# Altium project ASPLogger_Control_Unit.PrjPcb (part 2 of 2)

## Sheet ASP.SchDoc
size A1; SheetNumber: 5; SheetTotal: 5; SPICEModelCacheHRBINYFA: <root> / <DocumentId>HRBINYFA</DocumentId> / <CacheFrame Number="0"> / <Model Name="cap" Kind="MDL"> / <Text>*Default semiconductor capacitor / .MODEL CAP C()</Text> / </Model> / </CacheFrame> / </root>
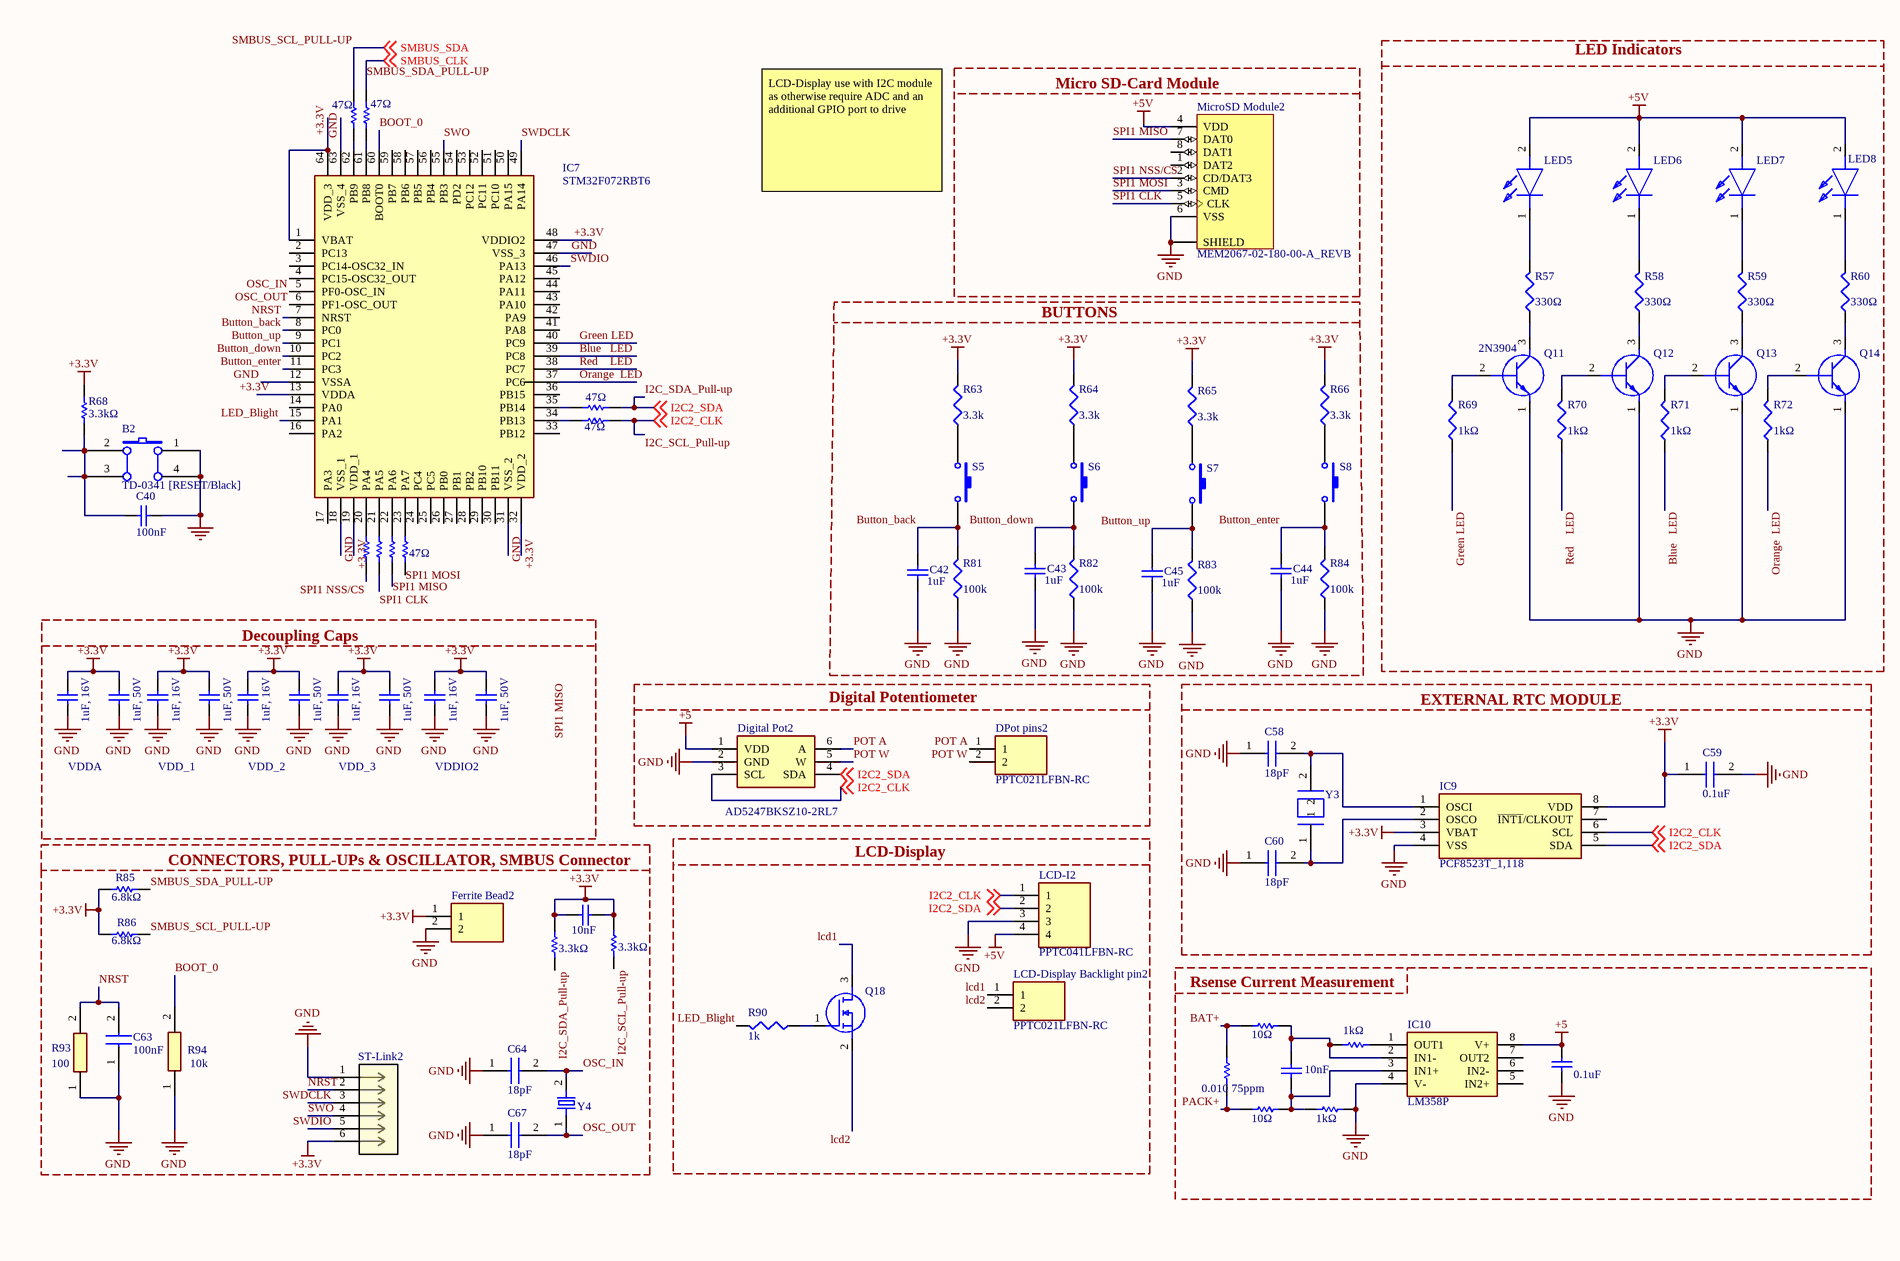
[diagram p4: ASP.SchDoc, left]
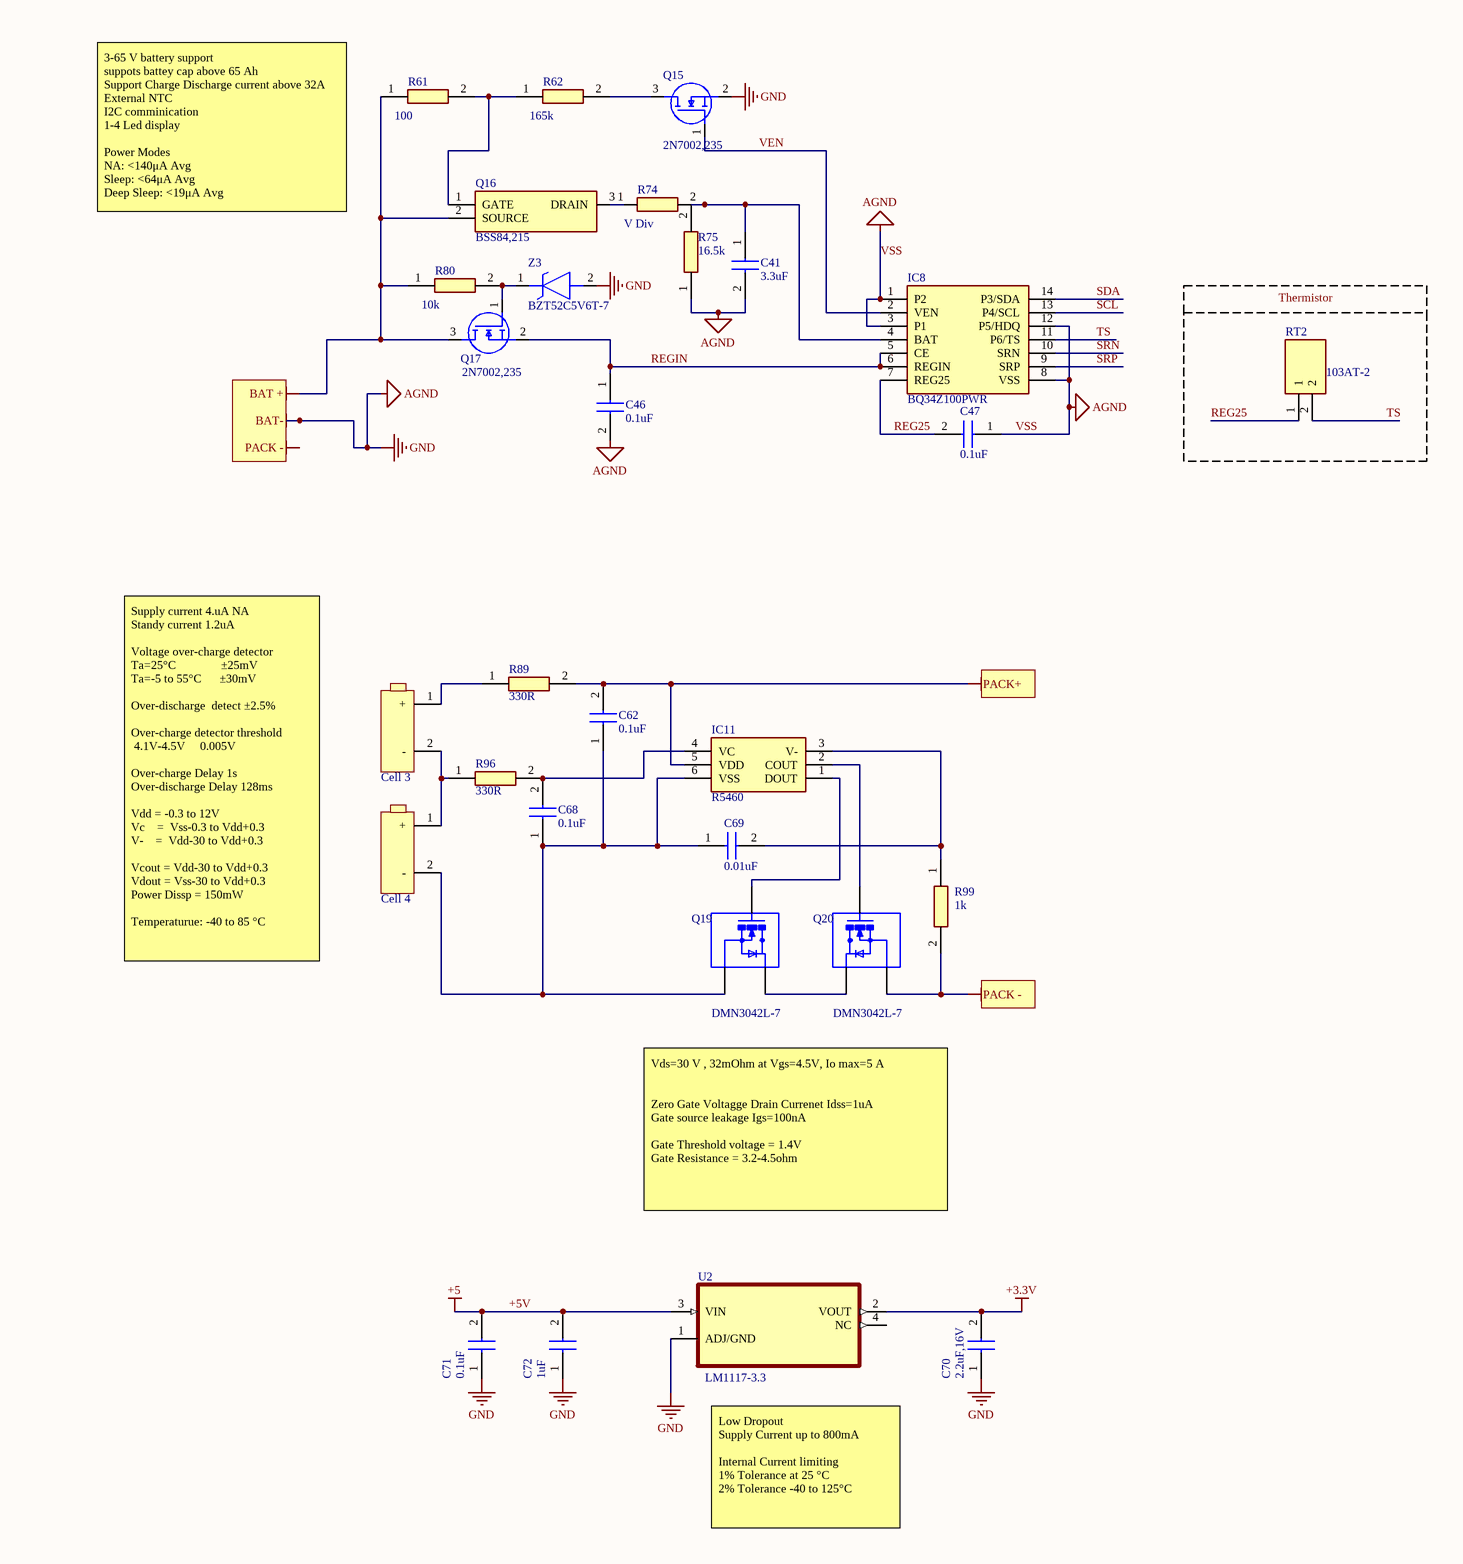
[diagram p5: ASP.SchDoc, right]

### Parts
B2  TD-0341 [RESET/Black]  [PB10]
C40  100nF  [0603C]
C41  3.3uF  [CAPC1608X90N]
C42  value 1uF  [RAD-0.3]  (hidden comment: Cap)
C43  value 1uF  [RAD-0.3]  (hidden comment: Cap)
C44  value 1uF  [RAD-0.3]  (hidden comment: Cap)
C45  value 1uF  [RAD-0.3]  (hidden comment: Cap)
C46  0.1uF  [CAPC1608X90N]
C47  0.1uF  [CAPC1608X90N]
C48  value 1uF, 16V  [RAD-0.3]  (hidden comment: Cap)
C49  value 1uF, 50V  [RAD-0.3]  (hidden comment: Cap)
C50  value 1uF, 16V  [RAD-0.3]  (hidden comment: Cap)
C51  value 1uF, 50V  [RAD-0.3]  (hidden comment: Cap)
C52  value 1uF, 16V  [RAD-0.3]  (hidden comment: Cap)
C53  value 1uF, 50V  [RAD-0.3]  (hidden comment: Cap)
C54  value 1uF, 16V  [RAD-0.3]  (hidden comment: Cap)
C55  value 1uF, 50V  [RAD-0.3]  (hidden comment: Cap)
C56  value 1uF, 16V  [RAD-0.3]  (hidden comment: Cap)
C57  value 1uF, 50V  [RAD-0.3]  (hidden comment: Cap)
C58  18pF  [CAPC3216X180N]
C59  0.1uF  [CAPC3216X180N]
C60  18pF  [CAPC3216X180N]
C61  value 10nF  [RAD-0.3]  (hidden comment: Cap)
C62  0.1uF  [CAPC3216X180N]
C63  100nF  [CAPC3216X180N]
C64  18pF  [CAPC3216X180N]
C65  value 0.1uF  [RAD-0.3]  (hidden comment: Cap)
C66  value 10nF  [RAD-0.3]  (hidden comment: Cap)
C67  18pF  [CAPC3216X180N]
C68  0.1uF  [CAPC3216X180N]
C69  0.01uF  [CAPC3216X180N]
C70  2.2uF,16V  [CAPC1608X90N]
C71  0.1uF  [CAPC1608X90N]
C72  1uF  [CAPC1608X90N]
Cell_3  Cell  [Cell]  (value not drawn)
Cell_4  Cell  [Cell]  (value not drawn)
Digital_Pot2  AD5247BKSZ10-2RL7  [SOT65P210X110-6N]
DPot_pins2  PPTC021LFBN-RC  [RHDR2W80P0X254_1X2_558X254X850P]
Ferrite_Bead2  2506033007Y3  [BEADC1608X110N]  (value not drawn)
IC7  STM32F072RBT6  [QFP50P1200X1200X160-64N]
IC8  BQ34Z100PWR  [SOP65P640X120-14N]
IC9  PCF8523T_1,118  [SOIC127P600X175-8N]
IC10  LM358P  [DIP794W53P254L959H508Q8N]
IC11  R5460  [SOT95P280X140-6N]
LCD-Display_Backlight_pin2  PPTC021LFBN-RC  [RHDR2W80P0X254_1X2_558X254X850P]
LCD-I2  PPTC041LFBN-RC  [RHDR4W80P0X254_1X4_1066X254X850P]
LED5  L-424IDT  [T-1_(3MM)_CYLINDRICAL_LED_LAMP]  (value not drawn)
LED6  L-424IDT  [T-1_(3MM)_CYLINDRICAL_LED_LAMP]  (value not drawn)
LED7  L-424IDT  [T-1_(3MM)_CYLINDRICAL_LED_LAMP]  (value not drawn)
LED8  L-424IDT  [T-1_(3MM)_CYLINDRICAL_LED_LAMP]  (value not drawn)
MicroSD_Module2  MEM2067-02-180-00-A_REVB  [GCT_MEM2067-02-180-00-A_REVB]
Q11  2N3904  [TO-92]
Q12  2n3904  [TO-92]  (value not drawn)
Q13  2n3904  [TO-92]  (value not drawn)
Q14  2n3904  [TO-92]  (value not drawn)
Q15  2N7002,235  [SOT95P230X110-3N]
Q16  BSS84,215  [SOT95P230X110-3N]
Q17  2N7002,235  [SOT95P230X110-3N]
Q18  DMG6968UQ-7  [SOT96P240X100-3N]  (value not drawn)
Q19  DMN3042L-7  [SOT91P240X110-3N]
Q20  DMN3042L-7  [SOT91P240X110-3N]
R55  value 47Ω  [AXIAL-0.3]  (hidden comment: Res1)
R56  value 47Ω  [AXIAL-0.3]  (hidden comment: Res1)
R57  value 330Ω  [J1-0603]  (hidden comment: 330)
R58  value 330Ω  [J1-0603]  (hidden comment: 330)
R59  value 330Ω  [J1-0603]  (hidden comment: 330)
R60  value 330Ω  [J1-0603]  (hidden comment: 330)
R61  100  [RESC1608X55N]
R62  165k  [RESC1608X55N]
R63  value 3.3k  [J1-0603]  (hidden comment: Res3)
R64  value 3.3k  [J1-0603]  (hidden comment: Res3)
R65  value 3.3k  [J1-0603]  (hidden comment: Res3)
R66  value 3.3k  [J1-0603]  (hidden comment: Res3)
R67  value 47Ω  [AXIAL-0.3]  (hidden comment: Res1)
R68  value 3.3kΩ  [AXIAL-0.3]  (hidden comment: Res1)
R69  value 1kΩ  [J1-0603]  (hidden comment: Res3)
R70  value 1kΩ  [J1-0603]  (hidden comment: Res3)
R71  value 1kΩ  [J1-0603]  (hidden comment: Res3)
R72  value 1kΩ  [J1-0603]  (hidden comment: Res3)
R73  value 47Ω  [AXIAL-0.3]  (hidden comment: Res1)
R74  V Div  [RESC1608X55N]
R75  16.5k  [RESC1608X55N]
R76  Res1  [AXIAL-0.3]  (value not drawn)
R77  Res1  [AXIAL-0.3]  (value not drawn)
R78  Res1  [AXIAL-0.3]  (value not drawn)
R79  value 47Ω  [AXIAL-0.3]  (hidden comment: Res1)
R80  10k  [RESC1608X55N]
R81  value 100k  [J1-0603]  (hidden comment: Res3)
R82  value 100k  [J1-0603]  (hidden comment: Res3)
R83  value 100k  [J1-0603]  (hidden comment: Res3)
R84  value 100k  [J1-0603]  (hidden comment: Res3)
R85  value 6.8kΩ  [AXIAL-0.3]  (hidden comment: Res1)
R86  value 6.8kΩ  [AXIAL-0.3]  (hidden comment: Res1)
R87  value 3.3kΩ  [AXIAL-0.3]  (hidden comment: Res1)
R88  value 3.3kΩ  [AXIAL-0.3]  (hidden comment: Res1)
R89  330R  [RESC1608X55N]
R90  value 1k  [J1-0603]  (hidden comment: Res3)
R91  value 10Ω  [AXIAL-0.3]  (hidden comment: Res1)
R92  value 1kΩ  [AXIAL-0.3]  (hidden comment: Res1)
R93  100  [RESC1608X55N]
R94  10k  [RESC1608X55N]
R95  value 0.010 75ppm  [AXIAL-0.3]  (hidden comment: Res1)
R96  330R  [RESC1608X55N]
R97  value 10Ω  [AXIAL-0.3]  (hidden comment: Res1)
R98  value 1kΩ  [AXIAL-0.3]  (hidden comment: Res1)
R99  1k  [RESC1608X55N]
RT2  103AT-2  [103AT2]
S5  SW-PB  [SPST-2]  (value not drawn)
S6  SW-PB  [SPST-2]  (value not drawn)
S7  SW-PB  [SPST-2]  (value not drawn)
S8  SW-PB  [SPST-2]  (value not drawn)
ST-Link2  20021121-00006C4LF  [CONN_20021121-00006C4LF_AMP-M]  (value not drawn)
U2  LM1117-3.3  [SOT230]
Y3  ABS07AIG-32.768KHZ-9-1-T  [XTAL320X150X90]  (value not drawn)
Y4  8 MHz ±20ppm  [XTAL500X320X130N]  (value not drawn)
Z3  BZT52C5V6T-7  [SODFL1608X65N]

### Blocks framed on the sheet
Micro SD-Card Module: MicroSD_Module2
LED Indicators: LED5-LED8 Q11-Q14 R57-R60 R69-R72
BUTTONS: C42-C45 R63-R66 R81-R84 S5-S8
Thermistor: RT2
Decoupling Caps: C48-C57
Digital Potentiometer: Digital_Pot2 DPot_pins2
LCD-Display: LCD-Display_Backlight_pin2 LCD-I2 Q18 R90
CONNECTORS, PULL-UPs & OSCILLATOR, SMBUS Connector: C61 C63 C64 C67 Ferrite_Bead2 R85-R88 R93 R94 ST-Link2 Y4

### Nets
+3.3V: C48.1 C49.1 C50.1 C51.1 C52.1 C53.1 C54.1 C55.1 C56.1 C57.1 C59.1 C61.1 C61.2 C70.2 Ferrite_Bead2.1 IC7.1(VBAT) IC7.13(VDDA) IC7.19(VDD_1) IC7.32(VDD_2) IC7.48(VDDIO2) IC7.64(VDD_3) IC9.3(VBAT) IC9.8(VDD) R63.2 R64.2 R65.2 R66.2 R68.2 R85.1 R86.1 R87.1 R88.1 ST-Link2.6 U2.2(VOUT)
+5V: C65.1 C71.2 C72.2 Digital_Pot2.1(VDD) IC10.8(V+) LCD-I2.4 LED5.2(A) LED6.2(A) LED7.2(A) LED8.2(A) MicroSD_Module2.4(VDD) U2.3(VIN)  [also labelled +5]
BAT +: Q16.2(SOURCE) Q17.3(D) R61.1 R80.1
BAT+: R91.2 R95.2
GND: B2.1(A0) B2.4(A1) C40.1 C41.2 C42.1 C43.1 C44.1 C45.1 C46.2 C47.1 C48.2 C49.2 C50.2 C51.2 C52.2 C53.2 C54.2 C55.2 C56.2 C57.2 C58.1 C59.2 C60.1 C63.1 C64.1 C65.2 C67.1 C70.1 C71.1 C72.1 Digital_Pot2.2(GND) Ferrite_Bead2.2 IC7.12(VSSA) IC7.18(VSS_1) IC7.31(VSS_2) IC7.47(VSS_3) IC7.63(VSS_4) IC8.1(P2) IC8.3(P1) IC8.8(VSS) IC8.9(SRP) IC8.10(SRN) IC8.12(P5/HDQ) IC9.4(VSS) IC10.4(V-) LCD-I2.3 MicroSD_Module2.6(VSS) MicroSD_Module2.9(SHIELD) MicroSD_Module2.10(SHIELD) MicroSD_Module2.11(SHIELD) MicroSD_Module2.12(SHIELD) Q11.1(E) Q12.1(E) Q13.1(E) Q14.1(E) Q15.2(S) R75.1 R81.1 R82.1 R83.1 R84.1 R93.1 R94.1 R98.1 ST-Link2.1 U2.1(ADJ/GND) Z3.2(A)  [also labelled AGND, BAT-, SRN, SRP, VSS]
PACK -: Q20.2(SOURCE) R99.2
PACK+: C62.2 IC11.5(VDD) R89.2 R95.1 R97.2
Blue   LED: IC7.39(PC8) R71.1
BOOT_0: IC7.60(BOOT0) R94.2
Button_back: C42.2 IC7.8(PC0) R81.2 S5.2
Button_down: C43.2 IC7.10(PC2) R82.2 S6.2
Button_enter: C44.2 IC7.11(PC3) R84.2 S8.2
Button_up: C45.2 IC7.9(PC1) R83.2 S7.2
Green LED: IC7.40(PC9) R69.1
I2C_SCL_Pull-up: Digital_Pot2.3(SCL) IC9.6(SCL) LCD-I2.1 R73.2 R88.2 ; off-sheet I2C2_CLK  [also labelled I2C2_CLK]
I2C_SDA_Pull-up: Digital_Pot2.4(SDA) IC9.5(SDA) LCD-I2.2 R67.2 R87.2 ; off-sheet I2C2_SDA  [also labelled I2C2_SDA]
lcd1: LCD-Display_Backlight_pin2.1 Q18.3(D)
lcd2: LCD-Display_Backlight_pin2.2 Q18.2(S)
LED_Blight: IC7.15(PA1) R90.2
NRST: C63.2 IC7.7(NRST) R93.2 ST-Link2.2
Orange  LED: IC7.37(PC6) R72.1
OSC_IN: C64.2 IC7.5(PF0-OSC_IN) Y4.2
OSC_OUT: C67.2 IC7.6(PF1-OSC_OUT) Y4.1
POT A: Digital_Pot2.6(A) DPot_pins2.1
POT W: Digital_Pot2.5(W) DPot_pins2.2
Red    LED: IC7.38(PC7) R70.1
REG25: C47.2 IC8.7(REG25) RT2.1
REGIN: C46.1 IC8.5(CE) IC8.6(REGIN) Q17.2(S)
SCL: IC8.13(P4/SCL)
SDA: IC8.14(P3/SDA)
SMBUS_SCL_PULL-UP: R55.2 R86.2 ; off-sheet SMBUS_SDA  [also labelled SMBUS_SDA]
SMBUS_SDA_PULL-UP: R56.2 R85.2 ; off-sheet SMBUS_CLK  [also labelled SMBUS_CLK]
SPI1 CLK: MicroSD_Module2.5(CLK) R77.1
SPI1 MISO: MicroSD_Module2.7(DAT0) R78.1
SPI1 MOSI: MicroSD_Module2.3(CMD) R79.1
SPI1 NSS/CS: MicroSD_Module2.2(CD/DAT3) R76.1
SWDCLK: IC7.49(PA14) ST-Link2.3
SWDIO: IC7.46(PA13) ST-Link2.5
SWO: IC7.55(PB3) ST-Link2.4
TS: IC8.11(P6/TS) RT2.2
VEN: IC8.2(VEN) Q15.1(G)
NetB2_2: B2.2(B0) B2.3(B1) C40.2 R68.1
NetC41_1: C41.1 IC8.4(BAT) R74.2 R75.2
NetC58_2: C58.2 IC9.1(OSCI) Y3.2
NetC60_2: C60.2 IC9.2(OSCO) Y3.1
NetC62_1: C62.1 C68.1 C69.1 Cell_4.2(-) IC11.6(VSS) Q19.2(SOURCE)
NetC66_1: C66.1 IC10.3(IN1+) R97.1 R98.2
NetC66_2: C66.2 IC10.2(IN1-) R91.1 R92.2
NetC68_2: C68.2 IC11.4(VC) R96.2
NetC69_2: C69.2 IC11.3(V-) R99.1
NetCell_3_1: Cell_3.1(+) R89.1
NetCell_3_2: Cell_3.2(-) Cell_4.1(+) R96.1
NetIC7_20: IC7.20(PA4) R76.2
NetIC7_21: IC7.21(PA5) R77.2
NetIC7_22: IC7.22(PA6) R78.2
NetIC7_23: IC7.23(PA7) R79.2
NetIC7_34: IC7.34(PB13) R73.1
NetIC7_35: IC7.35(PB14) R67.1
NetIC7_61: IC7.61(PB8) R56.1
NetIC7_62: IC7.62(PB9) R55.1
NetIC10_1: IC10.1(OUT1) R92.1
NetIC11_1: IC11.1(DOUT) Q19.1(GATE)
NetIC11_2: IC11.2(COUT) Q20.1(GATE)
NetLED5_1: LED5.1(K) R57.2
NetLED6_1: LED6.1(K) R58.2
NetLED7_1: LED7.1(K) R59.2
NetLED8_1: LED8.1(K) R60.2
NetQ11_2: Q11.2(B) R69.2
NetQ11_3: Q11.3(C) R57.1
NetQ12_2: Q12.2(B) R70.2
NetQ12_3: Q12.3(C) R58.1
NetQ13_2: Q13.2(B) R71.2
NetQ13_3: Q13.3(C) R59.1
NetQ14_2: Q14.2(B) R72.2
NetQ14_3: Q14.3(C) R60.1
NetQ15_3: Q15.3(D) R62.2
NetQ16_1: Q16.1(GATE) R61.2 R62.1
NetQ16_3: Q16.3(DRAIN) R74.1
NetQ17_1: Q17.1(G) R80.2 Z3.1(K)
NetQ18_1: Q18.1(G) R90.1
NetQ19_3: Q19.3(DRAIN) Q20.3(DRAIN)
NetR63_1: R63.1 S5.1
NetR64_1: R64.1 S6.1
NetR65_1: R65.1 S7.1
NetR66_1: R66.1 S8.1

Not connected (* = marked no-connect by the designer): IC7 2(PC13) 3(PC14-OSC32_IN) 4(PC15-OSC32_OUT) 14(PA0) 16(PA2) 17(PA3) 24(PC4) 25(PC5) 26(PB0) 27(PB1) 28(PB2) 29(PB10) 30(PB11) 33(PB12) 36(PB15) 41(PA8) 42(PA9) 43(PA10) 44(PA11) 45(PA12) 50(PA15) 51(PC10) 52(PC11) 53(PC12) 54(PD2) 56(PB4) 57(PB5) 58(PB6) 59(PB7); IC9 7(~{INT1}/CLKOUT); IC10 5(IN2+) 6(IN2-) 7(OUT2); MicroSD_Module2 1(DAT2) 8(DAT1); U2 4(NC)

### Notes on the sheet
- LCD-Display use with I2C module as otherwise require ADC and an additional GPIO port to drive
- 3-65 V battery support
  suppots battey cap above 65 Ah
  Support Charge Discharge current above 32A
  External NTC
  I2C comminication
  1-4 Led display
  Power Modes
  NA: <140μA Avg
  Sleep: <64μA Avg
  Deep Sleep: <19μA Avg
- EXTERNAL RTC MODULE
- VDDA
- VDD_1
- VDD_2
- VDD_3
- VDDIO2
- Supply current 4.uA NA
  Standy current 1.2uA
  Voltage over-charge detector
  Ta=25°C               ±25mV
  Ta=-5 to 55°C      ±30mV
  Over-discharge  detect ±2.5%
  Over-charge detector threshold
  4.1V-4.5V     0.005V
  Over-charge Delay 1s
  Over-discharge Delay 128ms
  Vdd = -0.3 to 12V
  Vc    =  Vss-0.3 to Vdd+0.3
  V-    =  Vdd-30 to Vdd+0.3
  Vcout = Vdd-30 to Vdd+0.3
  Vdout = Vss-30 to Vdd+0.3
  Power Dissp = 150mW
  Temperaturue: -40 to 85 °C
- Rsense Current Measurement
- (near IC10) Noise can propagate into analog circuitry through the power pins of the circuit as a whole, as well as the operational amplifier. Bypass capacitors are used to reduce the coupled noise by providing low-impedance power sources local to the analog circuitry.
- Vds=30 V , 32mOhm at Vgs=4.5V, Io max=5 A
  Zero Gate Voltagge Drain Currenet Idss=1uA
  Gate source leakage Igs=100nA
  Gate Threshold voltage = 1.4V
  Gate Resistance = 3.2-4.5ohm
- Low Dropout
  Supply Current up to 800mA
  Internal Current limiting
  1% Tolerance at 25 °C
  2% Tolerance -40 to 125°C
- Labels drawn without touching a wire or pin: PACK -, SPI1 MISO

### Library data of the parts
B2 = SW PUSHBUTTON: SE PUSHBUTTON
C40 = CAP: Capacitor; Value: 100pF; Published: 8-Jun-2000; Revision: July-2002: Re-released for DXP Platform.; Publisher: Altium Limited
C41 C46 C47 C70-C72 = EMK107B7104KAHT: Capacitor; Manufacturer_Name: TAIYO YUDEN; Datasheet Link: https://componentsearchengine.com/Datasheets/2/EMK107B7104KAHT.pdf; Height: 0.9mm; Manufacturer_Part_Number: EMK107B7104KAHT; Mouser Part Number: 963-EMK107B7104KAHT; Mouser Price/Stock: https://www.mouser.co.uk/ProductDetail/Taiyo-Yuden/EMK107B7104KAHT?qs=Va%252BXcMGJzEvYcymJV6GEGg%3D%3D
C42-C45 C48-C57 C61 C65 C66 = Cap: Capacitor; Published: 8-Jun-2000; LatestRevisionDate: 17-Jul-2002; LatestRevisionNote: Re-released for DXP Platform.; PackageReference: RAD-0.3; Publisher: Altium Limited; PackageDescription: Radial Cap, Thru-Hole; 2 Leads; 0.3 in Pin Spacing
C58-C60 C62-C64 C67-C69 = GRM31CD80J107MEA8L: Capacitor; Manufacturer_Name: Murata Electronics; Height: 1.8mm; Manufacturer_Part_Number: GRM31CD80J107MEA8L; Mouser Part Number: 81-GRM31CD80J107MA8L; Mouser Price/Stock: https://www.mouser.co.uk/ProductDetail/Murata-Electronics/GRM31CD80J107MEA8L?qs=DPoM0jnrROWnWfPYsqocbw%3D%3D
Digital_Pot2 = AD5247BKSZ10-2RL7: Integrated Circuit; Manufacturer_Name: Analog Devices; Datasheet Link: https://www.analog.com/media/en/technical-documentation/data-sheets/AD5247.pdf; Height: 1.1mm; Manufacturer_Part_Number: AD5247BKSZ10-2RL7; Mouser Part Number: 584-AD5247BKSZ10-2R7; Mouser Price/Stock: https://www.mouser.co.uk/ProductDetail/Analog-Devices/AD5247BKSZ10-2RL7?qs=NmRFExCfTkEuDqKDhhBFmQ%3D%3D; Arrow Part Number: AD5247BKSZ10-2RL7; Arrow Price/Stock: https://www.arrow.com/en/products/ad5247bksz10-2rl7/analog-devices
DPot_pins2 LCD-Display_Backlight_pin2 = PPTC021LFBN-RC: Connector; Manufacturer_Name: Sullins; Datasheet Link: http://www.sullinscorp.com/drawings/78_P(N)PxCxxxLFBN-RC,_10492-H.pdf; Height: 8.5mm; Manufacturer_Part_Number: PPTC021LFBN-RC
Ferrite_Bead2 = 2506033007Y3: Ferrite Bead / 100 MHz, 3A, 40 Ohm; Manufacturer_Name: Fair-Rite; Datasheet Link: https://www.fair-rite.com/product/chip-beads-2506033007y3/; Height: 1.1mm; Manufacturer_Part_Number: 2506033007Y3; Mouser Part Number: 623-2506033007Y3; Mouser Price/Stock: https://www.mouser.co.uk/ProductDetail/Fair-Rite/2506033007Y3?qs=paL1wOLBYNf20sf8jiNk7A%3D%3D; Arrow Part Number: 2506033007Y3; Arrow Price/Stock: https://www.arrow.com/en/products/2506033007y3/fair-rite-products
IC7 = STM32F072RBT6: Integrated Circuit; Manufacturer_Name: STMicroelectronics; Datasheet Link: http://www.st.com/st-web-ui/static/active/en/resource/technical/document/datasheet/DM00090510.pdf; Height: 1.6mm; Manufacturer_Part_Number: STM32F072RBT6; Mouser Part Number: 511-STM32F072RBT6; Mouser Price/Stock: https://www.mouser.co.uk/ProductDetail/STMicroelectronics/STM32F072RBT6?qs=xf9JV0PLFEcuk6sTlnutaw%3D%3D; Arrow Part Number: STM32F072RBT6; Arrow Price/Stock: https://www.arrow.com/en/products/stm32f072rbt6/stmicroelectronics
IC8 = BQ34Z100PWR: Integrated Circuit; Manufacturer_Name: Texas Instruments; Datasheet Link: https://www.ti.com/lit/ds/symlink/bq34z100.pdf?HQS=dis-dk-null-digikeymode-dsf-pf-null-wwe&ts=1639563438358&ref_url=https%253A%252F%252Fwww.ti.com%252Fgeneral%252Fdocs%252Fsuppproductinfo.tsp%253FdistId%253D10%2526gotoUrl%253Dhttps%253A%252F%252Fwww.ti.co; Height: 1.2mm; Manufacturer_Part_Number: BQ34Z100PWR; Mouser Part Number: 595-BQ34Z100PWR; Mouser Price/Stock: https://www.mouser.co.uk/ProductDetail/Texas-Instruments/BQ34Z100PWR?qs=Zv8nmyeoaKtU157avFmCXg%3D%3D; Arrow Part Number: BQ34Z100PWR; Arrow Price/Stock: https://www.arrow.com/en/products/bq34z100pwr/texas-instruments
IC9 = PCF8523T_1,118: Integrated Circuit; Manufacturer_Name: NXP; Manufacturer_Part_Number: PCF8523T/1,118; Datasheet Link: http://www.nxp.com/docs/en/data-sheet/PCF8523.pdf; Height: 1.75mm; Mouser Part Number: 771-PCF8523T/1118; Mouser Price/Stock: https://www.mouser.co.uk/ProductDetail/NXP-Semiconductors/PCF8523T-1118?qs=beN0Cyoe8YmmXShRMIPCwg%3D%3D; Arrow Part Number: PCF8523T/1,118; Arrow Price/Stock: https://www.arrow.com/en/products/pcf8523t1118/nxp-semiconductors?region=nac
IC10 = LM358P: Integrated Circuit; Manufacturer_Name: Texas Instruments; Datasheet Link: http://www.ti.com/lit/ds/symlink/lm358a.pdf; Height: 5.08mm; Manufacturer_Part_Number: LM358P; Mouser Part Number: 595-LM358P; Mouser Price/Stock: https://www.mouser.co.uk/ProductDetail/Texas-Instruments/LM358P?qs=X1HXWTtiZ0QtOTT8%252BVnsyw%3D%3D; Arrow Part Number: LM358P; Arrow Price/Stock: https://www.arrow.com/en/products/lm358p/texas-instruments?region=nac
IC11 = R5460N212AF-TR-FE: Integrated Circuit; Manufacturer_Name: Ricoh; Datasheet Link: https://eagle.componentsearchengine.com/Datasheets/1/R5460N212AF-TR-FE.pdf; Height: 1.4mm; Manufacturer_Part_Number: R5460N212AF-TR-FE; Mouser Part Number: 848-R5460N212AF-TR; Mouser Price/Stock: https://www.mouser.co.uk/ProductDetail/Ricoh-Electronic-Devices-Company/R5460N212AF-TR-FE?qs=vLWxofP3U2zA%252BWVvFiMalQ%3D%3D
LCD-I2 = PPTC041LFBN-RC: Connector; Manufacturer_Name: Sullins; Datasheet Link: http://www.sullinscorp.com/drawings/78_P(N)PxCxxxLFBN-RC,_10492-H.pdf; Height: 8.5mm; Manufacturer_Part_Number: PPTC041LFBN-RC
LED5-LED8 = L-424IDT: LED; Manufacturer_Name: Kingbright; Datasheet Link: https://componentsearchengine.com/Datasheets/2/L-424IDT.pdf; Manufacturer_Part_Number: L-424IDT; Mouser Part Number: N/A; Mouser Price/Stock: https://www.mouser.com/Search/Refine.aspx?Keyword=N%2FA; Arrow Part Number: L-424IDT; Arrow Price/Stock: https://www.arrow.com/en/products/l-424idt/kingbright
MicroSD_Module2 = MEM2067-02-180-00-A_REVB: 8 Position Card Connector microSDâ„¢ Surface Mount, Right Angle Gold; MF: Global Connector Technology; Package: None; Value: *; Price: None; MP: MEM2067-02-180-00-A; SnapEDA_Link: https://www.snapeda.com/parts/MEM2067-02-180-00-A/Global%20Connector%20Technology/view-part/779218/?ref=snap; Availability: Unavailable
Q11 = 2N3904: Transistor BJT NPN; Manufacturer_Name: STMicroelectronics; Datasheet Link: https://datasheet.datasheetarchive.com/originals/distributors/Datasheets-5/DSA-93219.pdf; Manufacturer_Part_Number: 2n3904; Mouser Part Number: 511-2N3904; Mouser Price/Stock: https://www.mouser.co.uk/ProductDetail/STMicroelectronics/2N3904?qs=ljbEvF4DwOMFlSOlAhVGRg%3D%3D
Q12-Q14 = 2n3904: Transistor BJT NPN; Manufacturer_Name: STMicroelectronics; Datasheet Link: https://datasheet.datasheetarchive.com/originals/distributors/Datasheets-5/DSA-93219.pdf; Manufacturer_Part_Number: 2n3904; Mouser Part Number: 511-2N3904; Mouser Price/Stock: https://www.mouser.co.uk/ProductDetail/STMicroelectronics/2N3904?qs=ljbEvF4DwOMFlSOlAhVGRg%3D%3D
Q15 Q17 = 2N7002,235: MOSFET (N-Channel); Manufacturer_Name: Nexperia; Datasheet Link: https://assets.nexperia.com/documents/data-sheet/2N7002.pdf; Height: 1.1mm; Manufacturer_Part_Number: 2N7002,235; Mouser Part Number: 771-2N7002235; Mouser Price/Stock: https://www.mouser.co.uk/ProductDetail/Nexperia/2N7002235?qs=AX3SRYwdf7Gv59FeQZ%2FkYw%3D%3D; Arrow Part Number: 2N7002,235; Arrow Price/Stock: https://www.arrow.com/en/products/2n7002235/nexperia
Q16 = BSS84,215: Transistor; Manufacturer_Name: Nexperia; Datasheet Link: https://componentsearchengine.com/Datasheets/2/BSS84,215.pdf; Height: 1.1mm; Manufacturer_Part_Number: BSS84,215; Mouser Part Number: 771-BSS84-T/R; Mouser Price/Stock: https://www.mouser.co.uk/ProductDetail/Nexperia/BSS84215?qs=me8TqzrmIYUAnPU0lBnsXg%3D%3D; Arrow Part Number: BSS84,215; Arrow Price/Stock: https://www.arrow.com/en/products/bss84215/nexperia?region=nac
Q18 = DMG6968UQ-7: MOSFET (N-Channel); Manufacturer_Name: Diodes Inc.; Datasheet Link: https://www.arrow.com/en/products/dmg6968uq-7/diodes-incorporated; Height: 1mm; Manufacturer_Part_Number: DMG6968UQ-7; Mouser Part Number: 621-DMG6968UQ-7; Mouser Price/Stock: https://www.mouser.co.uk/ProductDetail/Diodes-Incorporated/DMG6968UQ-7?qs=MNIFWdyJgboErGB0%2FFpP4Q%3D%3D; Arrow Part Number: DMG6968UQ-7; Arrow Price/Stock: https://www.arrow.com/en/products/dmg6968uq-7/diodes-incorporated
Q19 Q20 = DMN3042L-7: N-Channel 30V 5.8A (Ta) 720mW (Ta) Surface Mount SOT-23; MF: Diodes Inc.; Value: *; Package: SOT-23-3 Diodes Inc.; Check_prices: https://www.snapeda.com/parts/DMN3042L-7/Diodes%20Inc./view-part/827647/?ref=eda; SnapEDA_Link: https://www.snapeda.com/parts/DMN3042L-7/Diodes%20Inc./view-part/827647/?ref=snap; Digi-Key_Part_Number: DMN3042L-7DICT-ND; MP: DMN3042L-7
R55 R56 R67 R68 R73 R79 R85-R88 R91 R92 R95 R97 R98 = Res1: Resistor; Published: 8-Jun-2000; LatestRevisionDate: 17-Jul-2002; LatestRevisionNote: Re-released for DXP Platform.; PackageReference: AXIAL-0.3; Publisher: Altium Limited; PackageDescription: Axial Device, Thru-Hole; 2 Leads; 0.3 in Pin Spacing
R57-R60 R63-R66 R69-R72 R81-R84 R90 = Res3: Resistor; Published: 8-Jun-2000; LatestRevisionDate: 29-May-2009; LatestRevisionNote: IPC-7351 Footprint Added.; PackageReference: J1-0603; Publisher: Altium Limited; PackageDescription: Chip Resistor
R61 R62 R74 R75 R80 R89 R96 R99 = CR0603-FX-1003ELF: Resistor; Manufacturer_Name: Bourns; Datasheet Link: https://www.bourns.com/pdfs/chpreztr.pdf; Height: 0.55mm; Manufacturer_Part_Number: CR0603-FX-1003ELF; Mouser Part Number: 652-CR0603-FX-103ELF; Mouser Price/Stock: https://www.mouser.co.uk/ProductDetail/Bourns/CR0603-FX-1003ELF?qs=K5ddiUFZPT49r0RoKWcKqg%3D%3D; Arrow Part Number: CR0603-FX-1003ELF; Arrow Price/Stock: https://www.arrow.com/en/products/cr0603-fx-1003elf/bourns?region=europe
R76 = Res1: Resistor; Value: 1kΩ; Published: 8-Jun-2000; LatestRevisionDate: 17-Jul-2002; LatestRevisionNote: Re-released for DXP Platform.; PackageReference: AXIAL-0.3; Publisher: Altium Limited; PackageDescription: Axial Device, Thru-Hole; 2 Leads; 0.3 in Pin Spacing
R77 R78 = Res1: Resistor; Value: 47Ω; Published: 8-Jun-2000; LatestRevisionDate: 17-Jul-2002; LatestRevisionNote: Re-released for DXP Platform.; PackageReference: AXIAL-0.3; Publisher: Altium Limited; PackageDescription: Axial Device, Thru-Hole; 2 Leads; 0.3 in Pin Spacing
R93 R94 = CRG0603F470R: Resistor; Manufacturer_Name: TE Connectivity; Datasheet Link: https://datasheet.datasheetarchive.com/originals/distributors/DKDS-21/401698.pdf; Height: 0.55mm; Manufacturer_Part_Number: CRG0603F470R; Mouser Part Number: 279-CRG0603F470R; Mouser Price/Stock: https://www.mouser.co.uk/ProductDetail/TE-Connectivity-Holsworthy/CRG0603F470R?qs=VHcS2MTj4gZ9vO%2FWGoSTFA%3D%3D; Arrow Part Number: CRG0603F470R; Arrow Price/Stock: https://www.arrow.com/en/products/crg0603f470r/te-connectivity?region=nac
RT2 = 103AT-2: Thermistor; Manufacturer_Name: Semitec; Datasheet Link: https://datasheet.datasheetarchive.com/originals/distributors/Datasheets-30/DSA-588185.pdf; Height: 8mm; Manufacturer_Part_Number: 103AT-2; Mouser Part Number: 954-103AT-2; Mouser Price/Stock: https://www.mouser.co.uk/ProductDetail/Semitec/103AT-2?qs=wgO0AD0o1vvcDzsKguD%252Bew%3D%3D
S5-S8 = SW-PB: Switch; Published: 24-Mar-1999; LatestRevisionDate: 17-Jul-2002; LatestRevisionNote: Re-released for DXP Platform.; PackageReference: SPST-2; Publisher: Altium Limited; PackageDescription: Switch; 2 Leads
ST-Link2 = 20021121-00006C4LF: ST-Link; Mfr_Name: Amphenol ICC; Manufacturer_Part_Number: 20021121-00006C4LF; Copyright: Copyright (C) 2022 Ultra Librarian. All rights reserved.; RefDes: RefDes; Type: DEV
U2 = LM1117-3.3: Regulador de tensÃ£o linear IC 1 Output 800mA SOT-223-4; MF: Texas Instruments; MP: LM1117-3.3; Package: SOT-223-4 Texas Instruments; Price: None; Availability: Unavailable; SnapEDA_Link: https://www.snapeda.com/parts/LM1117-3.3/Texas%20Instruments/view-part/549181/?ref=snap; Value: *
Y3 = ABS07AIG-32.768KHZ-9-1-T: 32.768kHz Â±10ppm Crystal 9pF 80 kOhms 2-SMD, No Lead; MF: Abracon; Package: SMD-2 Abracon; MP: ABS07AIG-32.768KHZ-9-1-T; SnapEDA_Link: https://www.snapeda.com/parts/ABS07AIG-32.768KHZ-9-1-T/Abracon%20LLC/view-part/588516/?ref=snap; Price: None; Value: *; Availability: Unavailable
Y4 = ABM3-16.000MHZ-D2Y-T: 16MHz Â±20ppm Crystal 18pF 40 Ohms 2-SMD, No Lead; MF: Abracon; SnapEDA_Link: https://www.snapeda.com/parts/ABM3-16.000MHZ-D2Y/Abracon/view-part/1217081/?ref=snap; MP: ABM3-16.000MHZ-D2Y; Availability: Unavailable; Package: SMD-2 Abracon; Price: None; Value: *
Z3 = BZT52C5V6T-7: Zener Diode; Manufacturer_Name: Diodes Inc.; Datasheet Link: https://www.mouser.com/datasheet/2/115/ds30502-1142513.pdf; Height: 0.65mm; Manufacturer_Part_Number: BZT52C5V6T-7; Mouser Part Number: 621-BZT52C5V6T-7; Mouser Price/Stock: https://www.mouser.co.uk/ProductDetail/Diodes-Incorporated/BZT52C5V6T-7?qs=zLeapIUCO8Tm%252BIuaCPAdkQ%3D%3D; Arrow Part Number: BZT52C5V6T-7; Arrow Price/Stock: https://www.arrow.com/en/products/bzt52c5v6t-7/diodes-incorporated?region=nac

## Nets that join several sheets
+3.3V: Sheet1 (32 pins), LDO (C33.2 C34.2 IC5.3 U1.2), ASP (34 pins)
+5V: Sheet1 (9 pins), LDO (6 pins), ASP (12 pins)
BAT +: BQ34z100pwr (Q7.2 Q8.3 R42.1 R48.1), ASP (Q16.2 Q17.3 R61.1 R80.1)
BAT+: Sheet1 (R31.2 R35.2), BQ34z100pwr (R49.1 R51.2), ASP (R91.2 R95.2)
GND: Sheet1 (51 pins), BQ34z100pwr (22 pins), LDO (9 pins), ASP (67 pins)
PACK -: R5460 (Q10.2 R54.2), ASP (Q20.2 R99.2)
PACK+: Sheet1 (R35.1 R36.2), R5460 (C37.2 IC6.5 R52.2), ASP (5 pins)
Blue   LED: Sheet1 (IC1.39 R15.1), ASP (IC7.39 R71.1)
BOOT_0: Sheet1 (IC1.60 R34.2), ASP (IC7.60 R94.2)
Button_back: Sheet1 (C2.2 IC1.8 R22.2 S1.2), ASP (C42.2 IC7.8 R81.2 S5.2)
Button_down: Sheet1 (C3.2 IC1.10 R23.2 S2.2), ASP (C43.2 IC7.10 R82.2 S6.2)
Button_enter: Sheet1 (C4.2 IC1.11 R25.2 S4.2), ASP (C44.2 IC7.11 R84.2 S8.2)
Button_up: Sheet1 (C5.2 IC1.9 R24.2 S3.2), ASP (C45.2 IC7.9 R83.2 S7.2)
Green LED: Sheet1 (IC1.40 R13.1), ASP (IC7.40 R69.1)
I2C_SCL_Pull-up: Sheet1 (5 pins), ASP (5 pins)
I2C_SDA_Pull-up: Sheet1 (5 pins), ASP (5 pins)
lcd1: Sheet1 (LCD-Display_Backlight_pin1.1 Q5.3), ASP (LCD-Display_Backlight_pin2.1 Q18.3)
lcd2: Sheet1 (LCD-Display_Backlight_pin1.2 Q5.2), ASP (LCD-Display_Backlight_pin2.2 Q18.2)
LED_Blight: Sheet1 (IC1.15 R30.2), ASP (IC7.15 R90.2)
NRST: Sheet1 (8 pins), ASP (C63.2 IC7.7 R93.2 ST-Link2.2)
Orange  LED: Sheet1 (IC1.37 R16.1), ASP (IC7.37 R72.1)
OSC_IN: Sheet1 (C21.2 IC1.5 Y2.2), ASP (C64.2 IC7.5 Y4.2)
OSC_OUT: Sheet1 (C24.2 IC1.6 Y2.1), ASP (C67.2 IC7.6 Y4.1)
POT A: Sheet1 (Digital_Pot1.6 DPot_pins1.1), ASP (Digital_Pot2.6 DPot_pins2.1)
POT W: Sheet1 (Digital_Pot1.5 DPot_pins1.2), ASP (Digital_Pot2.5 DPot_pins2.2)
Red    LED: Sheet1 (IC1.38 R14.1), ASP (IC7.38 R70.1)
REG25: BQ34z100pwr (C27.2 IC4.7 RT1.1), ASP (C47.2 IC8.7 RT2.1)
REGIN: BQ34z100pwr (C26.1 IC4.5 IC4.6 Q8.2), ASP (C46.1 IC8.5 IC8.6 Q17.2)
SCL: BQ34z100pwr (IC4.13 R40.1), ASP (IC8.13)
SDA: BQ34z100pwr (IC4.14 R38.1), ASP (IC8.14)
SMBUS_SCL_PULL-UP: Sheet1 (R1.2 R27.2), ASP (R55.2 R86.2)
SMBUS_SDA_PULL-UP: Sheet1 (R2.2 R26.2), ASP (R56.2 R85.2)
SPI1 CLK: Sheet1 (MicroSD_Module1.5 R19.1), ASP (MicroSD_Module2.5 R77.1)
SPI1 MISO: Sheet1 (MicroSD_Module1.7 R20.1), ASP (MicroSD_Module2.7 R78.1)
SPI1 MOSI: Sheet1 (MicroSD_Module1.3 R21.1), ASP (MicroSD_Module2.3 R79.1)
SPI1 NSS/CS: Sheet1 (MicroSD_Module1.2 R18.1), ASP (MicroSD_Module2.2 R76.1)
SWDCLK: Sheet1 (IC1.49 ST-Link1.3), ASP (IC7.49 ST-Link2.3)
SWDIO: Sheet1 (IC1.46 ST-Link1.5), ASP (IC7.46 ST-Link2.5)
SWO: Sheet1 (IC1.55 ST-Link1.4), ASP (IC7.55 ST-Link2.4)
TS: BQ34z100pwr (IC4.11 RT1.2), ASP (IC8.11 RT2.2)
VEN: BQ34z100pwr (IC4.2 Q6.1), ASP (IC8.2 Q15.1)